# EAGLE design CX60-24S-UNIT (EAGLE 7.7.0)
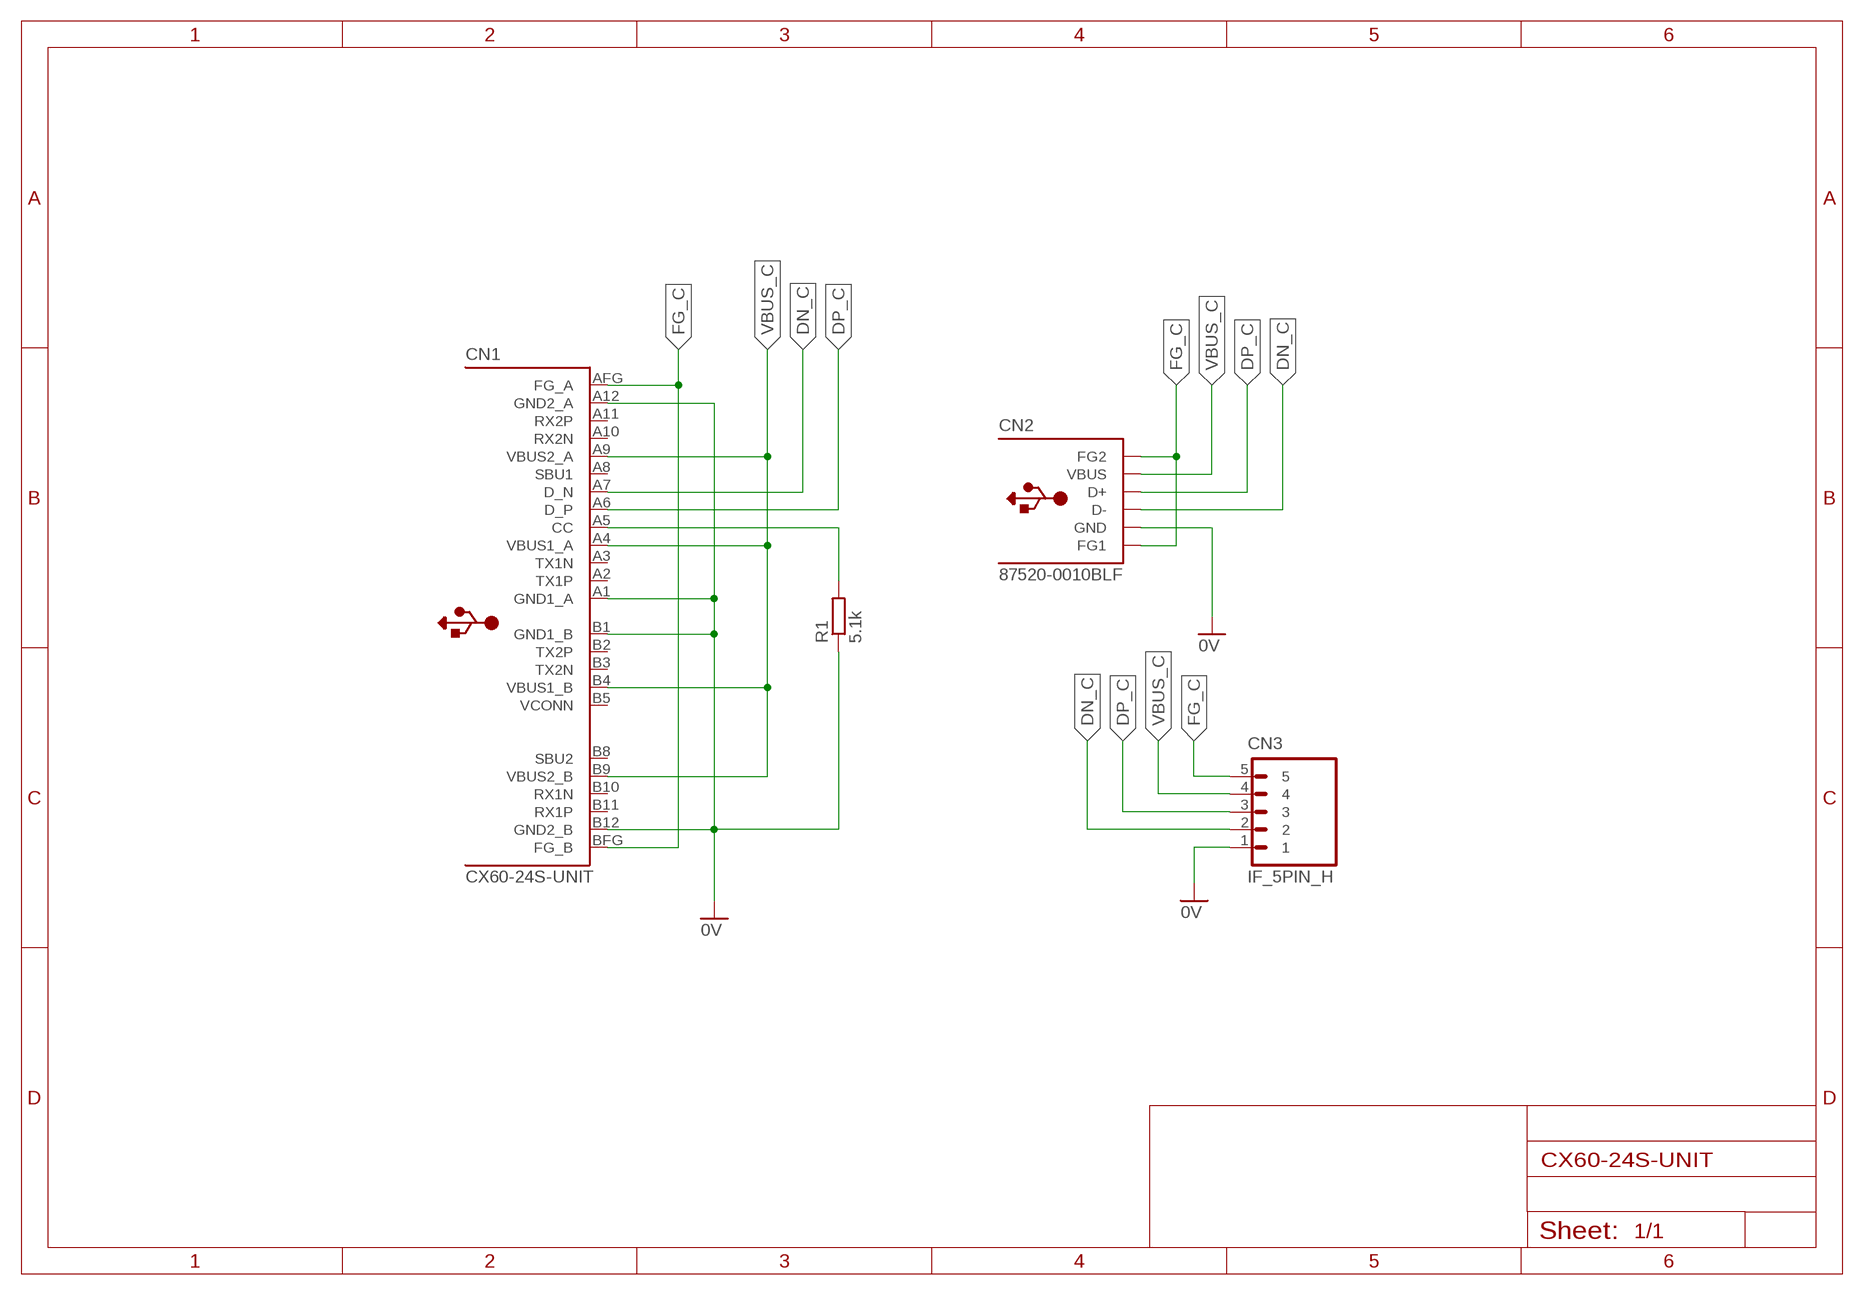
[diagram p0: schematic, sheet 1]

## Parts
CN1  CX60-24S-UNIT  [CX60-24S-UNIT]
CN2  87520-0010BLF  [87520-0010BLF]
CN3  IF_5PIN_H  [HEADER_5PIN]
R1  5.1k  RESISTOR_0402  [R0402]

## Nets
0V: CN1.A1(GND1_A) CN1.A12(GND2_A) CN1.B1(GND1_B) CN1.B12(GND2_B) CN2.GND CN3.1 R1.1
DN_C: CN1.A7(D_N) CN2.D- CN3.2
DP_C: CN1.A6(D_P) CN2.D+ CN3.3
FG_C: CN1.AFG(FG_A) CN1.BFG(FG_B) CN2.FG1 CN2.FG2 CN3.5
N$3: CN1.A5(CC) R1.2
VBUS_C: CN1.A4(VBUS1_A) CN1.A9(VBUS2_A) CN1.B4(VBUS1_B) CN1.B9(VBUS2_B) CN2.VBUS CN3.4
Unconnected: CN1.A2(TX1P) CN1.A3(TX1N) CN1.A8(SBU1) CN1.A10(RX2N) CN1.A11(RX2P) CN1.B2(TX2P) CN1.B3(TX2N) CN1.B5(VCONN) CN1.B8(SBU2) CN1.B10(RX1N) CN1.B11(RX1P)

## Library data of the parts
CN1 = Connectors:CX60-24S-UNIT: USB Type-C(TM) plug
CN2 = Connectors:87520-0010BLF: USB Type-A(TM) receptacle
CN3 = Connectors:IF_5PIN: 5-pin インターフェース
R1 = Parts:RESISTOR: 抵抗器

## Board
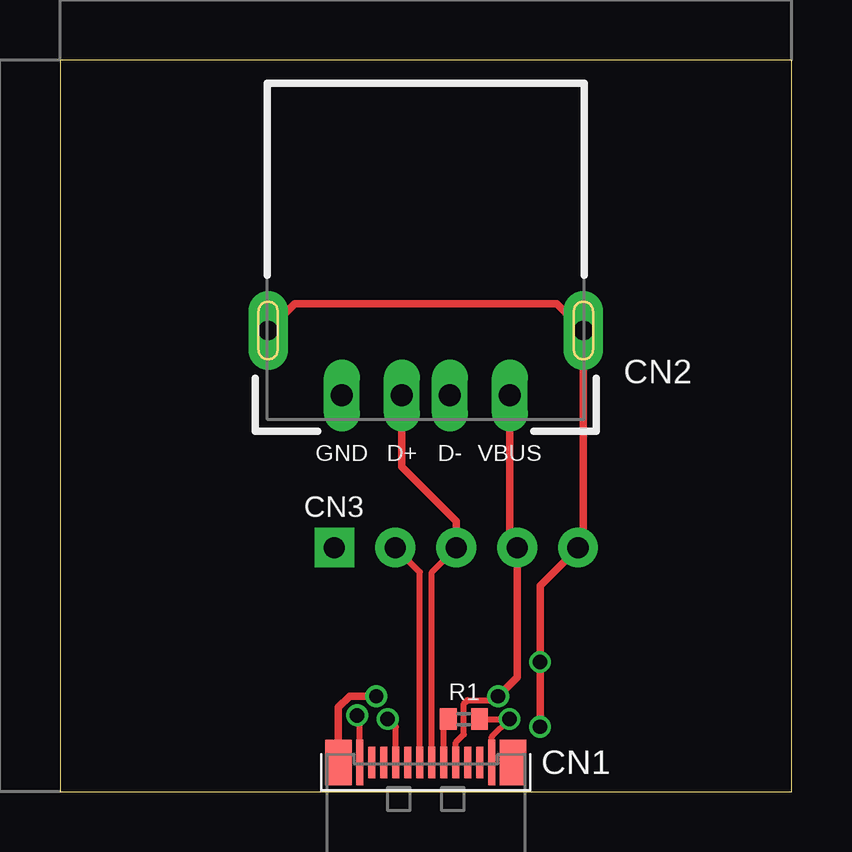
[diagram p1: board, top side]
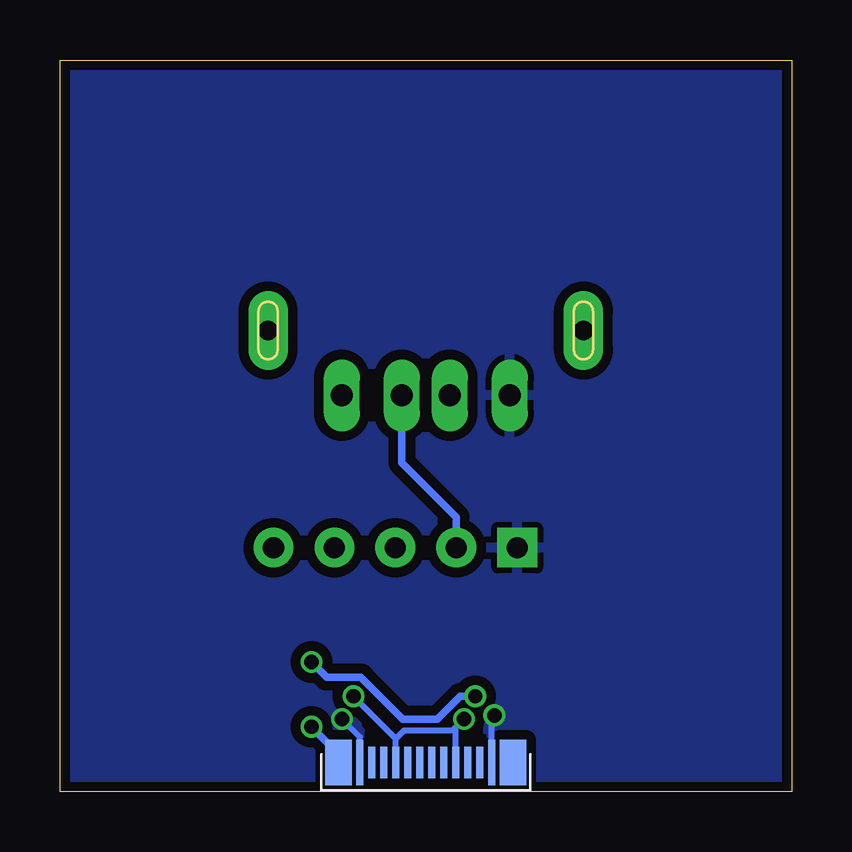
[diagram p2: board, bottom side, seen from below]

Size 30.48 x 30.48 mm. Coordinates in mm from the lower left corner, seen from the top.
Outline: 0,0 30.48,0 30.48,30.48 0,30.48 0,0
Copper layers (1*16): Top 0.035mm / dielectric 1.5mm / Bottom 0.035mm
Design rules "SeeedStudio_2layer_DRU_no_angle_20140221": minimum track width 6mil, minimum drill 12mil, track to track 6mil, track to pad 6mil, pad to pad 6mil, via to via 6mil, smd to smd 0mil, copper to edge 10mil, drill to drill 10mil, minimum pad ring 10mil, minimum via ring 6mil, stop-mask expansion 2mil, vias tented up to drill 100mil, thermal gap 10mil

### Footprints (pad centres in the part's own frame; a part is rotated, then mirrored left to right if it is on the bottom)
CX60-24S-UNIT = smd 0.3 x 1.9: A1 2.75,0; A12 -2.75,0 | smd 0.3 x 1.3: A2 2.25,0; A3 1.75,0; A4 1.25,0; A5 0.75,0; A6 0.25,0; A7 -0.25,0; A8 -0.75,0; A9 -1.25,0; A10 -1.75,0; A11 -2.25,0 | smd 1.1 x 1.9: ADUM 3.64,0; AFG -3.64,0 | smd 0.3 x 1.9 bottom: B1 -2.75,0; B12 2.75,0 | smd 0.3 x 1.3 bottom: B2 -2.25,0; B3 -1.75,0; B4 -1.25,0; B5 -0.75,0; B6 -0.25,0; B7 0.25,0; B8 0.75,0; B9 1.25,0; B10 1.75,0; B11 2.25,0 | smd 1.1 x 1.9 bottom: BDUM -3.64,0; BFG 3.64,0
87520-0010BLF = drill 0.92 pad 1.5 long: D+ -1,0; D- 1,0; GND -3.5,0; VBUS 3.5,0 | drill 0.8 pad 1.64 long: FG1 -6.57,2.7; FG2 6.57,2.7
HEADER_5PIN = drill 0.889 pad 1.651 square: 1 0,0 | drill 0.889 pad 1.651: 2 2.54,0; 3 5.08,0; 4 7.62,0; 5 10.16,0
R0402 = smd 0.7 x 0.9: 1 -0.65,0; 2 0.65,0

### Placement (x,y rotation side)
CN1  15.24,1.21 0 top
CN2  15.24,16.51 0 top
CN3  11.43,10.16 0 top
R1  16.83,3.02 180 top

### Tracks (layer width: path | path; a pad name or v marks a point on that pad's centre or on a via)
0V  (via drill 0.6)
  Top 0.254: CN1.A12 12.49,3.07 v12.38,3.17 | CN1.A1 17.99,2.27 v18.73,3.02 R1.1
  Bottom 0.254: CN1.A12 12.49,3.07 v12.38,3.17 | CN1.A1 17.99,2.27 v18.73,3.02
  pour Bottom (isolate 0.406, rank 3): -1.27,31.75 31.75,31.75 31.75,-1.27 -1.27,-1.27
DN_C
  Top 0.254: CN1.A7 14.99,9.14 CN3.2
  Bottom 0.305: CN3.2 13.97,11.43 16.24,13.7 CN2.D-
DP_C
  Top 0.254: CN1.A6 15.49,9.14 CN3.3
  Top 0.305: CN2.D+ 14.24,13.54 16.51,11.27 CN3.3
FG_C  (via drill 0.6)
  Top 0.305: CN1.AFG 11.6,3.5 12.06,3.97 v13.18,3.97 | CN2.FG1 9.78,20.32 20.7,20.32 CN2.FG2 21.81,10.38 CN3.5 20,8.57 v20,5.4 v20,2.7
  Bottom 0.305: 18.98,1.11 CN1.BFG 18.88,1.58 v20,2.7 | v13.18,3.97 13.81,3.97 14.76,3.02 16.19,3.02 17.94,4.76 19.37,4.76 v20,5.4
N$3
  Top 0.254: CN1.A5 15.99,2.83 R1.2
VBUS_C  (via drill 0.6)
  Top 0.254: CN1.A9 13.99,2.68 v13.65,3.02 | CN1.A4 16.49,2.04 16.83,2.38 16.83,3.65 16.99,3.81 18.1,3.81 v18.26,3.97
  Top 0.305: CN2.VBUS 18.74,10.47 CN3.4 19.05,4.76 v18.26,3.97
  Bottom 0.254: CN1.A4 16.49,2.2 | CN1.A9 13.99,2.68 v13.65,3.02 14.13,2.54 16.15,2.54 16.49,2.2 | 16.49,2.2 v18.26,3.97